# Altium schematic sheet SENSE.SchDoc: SENSE
size A4; DrawnBy: Lucas Church; DocumentNumber: N/A; Revision: A; SheetNumber: 5; SheetTotal: 6
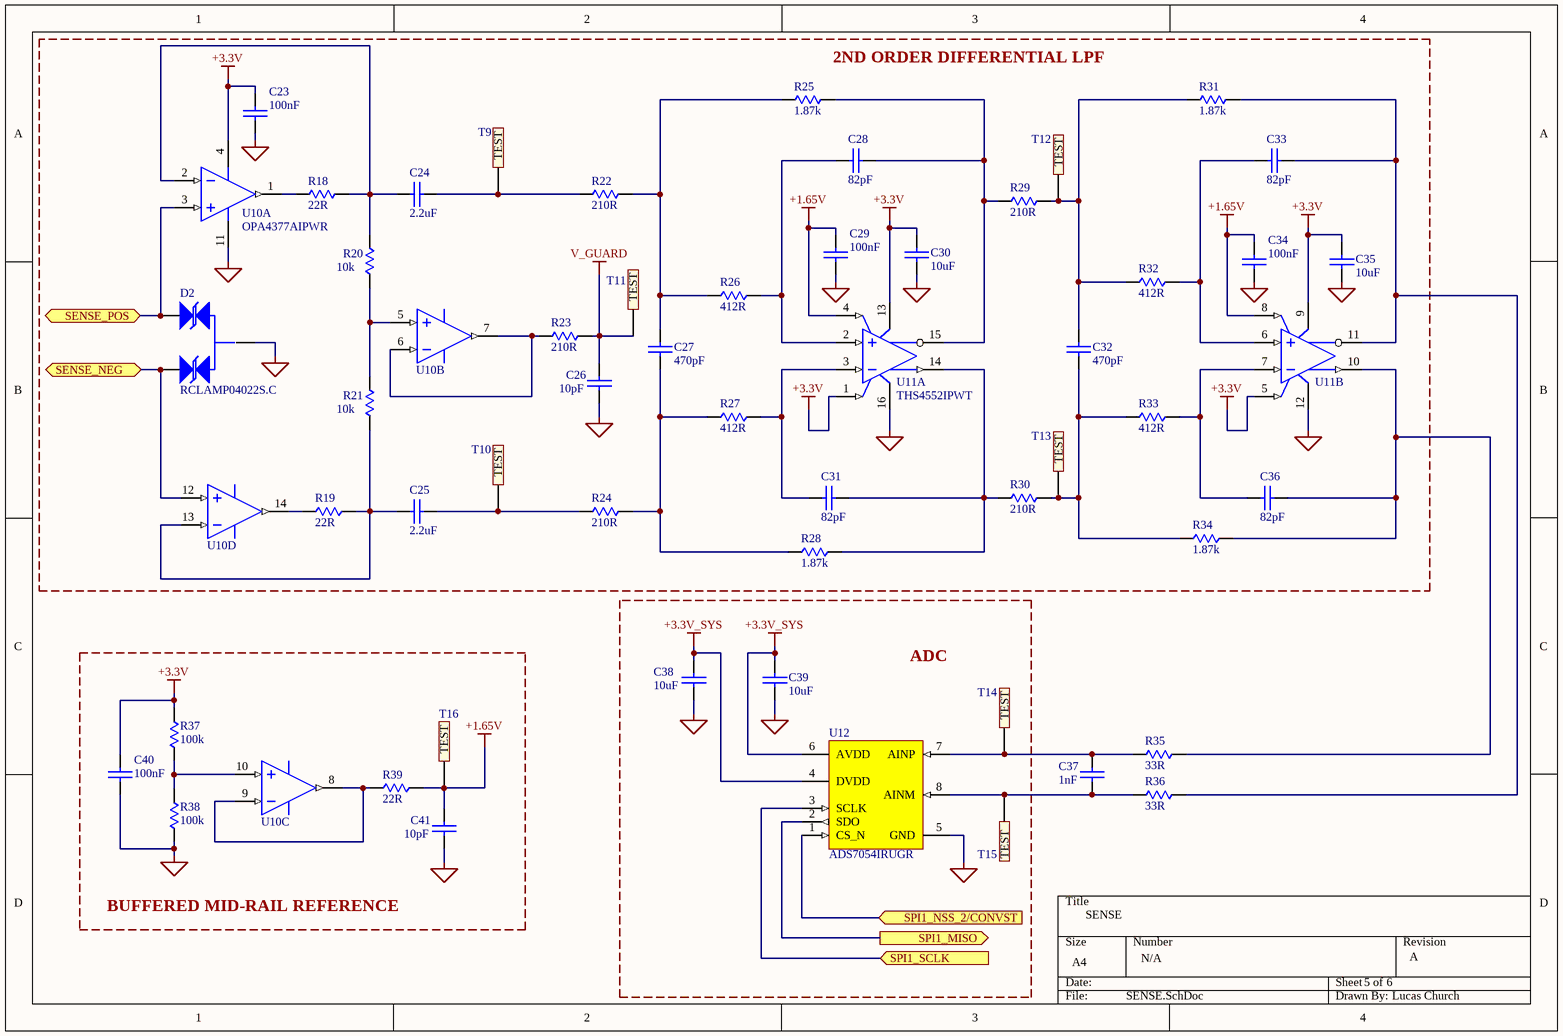
[diagram p0: SENSE.SchDoc]

## Parts
C23  100nF  [0603-CAP]
C24  2.2uF  [0603-CAP]
C25  2.2uF  [0603-CAP]
C26  10pF  [0603-CAP]
C27  470pF  [0603-CAP]
C28  82pF  [0603-CAP]
C29  100nF  [0603-CAP]
C30  10uF  [0603-CAP]
C31  82pF  [0603-CAP]
C32  470pF  [0603-CAP]
C33  82pF  [0603-CAP]
C34  100nF  [0603-CAP]
C35  10uF  [0603-CAP]
C36  82pF  [0603-CAP]
C37  1nF  [0603-CAP]
C38  10uF  [0603-CAP]
C39  10uF  [0603-CAP]
C40  100nF  [0603-CAP]
C41  10pF  [0603-CAP]
D2  RCLAMP04022S.C  [SOT-23 3L]
R18  22R  [0603-RES]
R19  22R  [0603-RES]
R20  10k  [0603-RES]
R21  10k  [0603-RES]
R22  210R  [0603-RES]
R23  210R  [0603-RES]
R24  210R  [0603-RES]
R25  1.87k  [0603-RES]
R26  412R  [0603-RES]
R27  412R  [0603-RES]
R28  1.87k  [0603-RES]
R29  210R  [0603-RES]
R30  210R  [0603-RES]
R31  1.87k  [0603-RES]
R32  412R  [0603-RES]
R33  412R  [0603-RES]
R34  1.87k  [0603-RES]
R35  33R  [0603-RES]
R36  33R  [0603-RES]
R37  100k  [0603-RES]
R38  100k  [0603-RES]
R39  22R  [0603-RES]
T9  5002K  [TESTPOINT White]  (value not drawn)
T10  5002K  [TESTPOINT White]  (value not drawn)
T11  5002K  [TESTPOINT White]  (value not drawn)
T12  5002K  [TESTPOINT White]  (value not drawn)
T13  5002K  [TESTPOINT White]  (value not drawn)
T14  5002K  [TESTPOINT White]  (value not drawn)
T15  5002K  [TESTPOINT White]  (value not drawn)
T16  5002K  [TESTPOINT White]  (value not drawn)
U10  OPA4377AIPWR  [PW0014A_N]  (parts A,B,C,D of 4)
U11  THS4552IPWT  [PW0016A_N]  (parts A,B of 2)
U12  ADS7054IRUGR  [8-X2QFN (1.5x1.5)]

## Blocks framed on the sheet
2ND ORDER DIFFERENTIAL LPF: C23-C36 D2 R18-R34 T9-T13 U10 U11
ADC: C38 C39 T14 T15 U12
BUFFERED MID-RAIL REFERENCE: C40 C41 R37-R39 T16 U10

## Ports
SENSE_NEG (bidir, see BLOCK DIAGRAM[3C], LOADS[4A]), SENSE_POS (bidir, see BLOCK DIAGRAM[3C], LOADS[4A]), SPI1_MISO (out, see BLOCK DIAGRAM[2C], MCU[1A]), SPI1_NSS_2/CONVST (in, see BLOCK DIAGRAM[2C], MCU[3A]), SPI1_SCLK (in, see BLOCK DIAGRAM[2C], MCU[1A])

## Nets
+1.65V: C29.1 C34.1 C41.1 R39.2 T16.1(TEST) U11.4(VOCM1) U11.8(VOCM2)
+3.3V: C23.1 C30.1 C35.1 C40.1 R37.2 U10.4(V+) U11.1(PD1_N) U11.5(PD2_N) U11.9(VS2+) U11.13(VS1+)
+3.3V_SYS: C38.1 C39.1 U12.4(DVDD) U12.6(AVDD)
GND: C23.2 C26.2 C29.2 C30.2 C34.2 C35.2 C38.2 C39.2 C40.2 C41.2 D2.3 R38.1 U10.11(V-) U11.12(VS-) U11.16(VS-) U12.5(GND)
V_GUARD: C26.1 R23.2 T11.1(TEST)
SENSE_NEG: D2.2 U10.12(IN_D+) ; port SENSE_NEG
SENSE_POS: D2.1 U10.3(IN_A+) ; port SENSE_POS
SPI1_MISO: U12.2(SDO) ; port SPI1_MISO
SPI1_NSS_2/CONVST: U12.1(CS_N) ; port SPI1_NSS_2/CONVST
SPI1_SCLK: U12.3(SCLK) ; port SPI1_SCLK
NetC24_1: C24.1 R22.1 T9.1(TEST)
NetC24_2: C24.2 R18.2 R20.1 U10.2(IN_A-)
NetC25_1: C25.1 R24.1 T10.1(TEST)
NetC25_2: C25.2 R19.2 R21.2 U10.13(IN_D-)
NetC27_1: C27.1 R24.2 R27.1 R28.1
NetC27_2: C27.2 R22.2 R25.1 R26.1
NetC28_1: C28.1 R26.2 U11.2(VIN1+)
NetC28_2: C28.2 R25.2 R29.1 U11.15(VOUT1-)
NetC31_1: C31.1 R27.2 U11.3(VIN1-)
NetC31_2: C31.2 R28.2 R30.1 U11.14(VOUT1+)
NetC32_1: C32.1 R30.2 R33.1 R34.1 T13.1(TEST)
NetC32_2: C32.2 R29.2 R31.1 R32.1 T12.1(TEST)
NetC33_1: C33.1 R32.2 U11.6(VIN2+)
NetC33_2: C33.2 R31.2 R36.2 U11.11(VOUT2-)
NetC36_1: C36.1 R33.2 U11.7(VIN2-)
NetC36_2: C36.2 R34.2 R35.2 U11.10(VOUT2+)
NetC37_1: C37.1 R35.1 T14.1(TEST) U12.7(AINP)
NetC37_2: C37.2 R36.1 T15.1(TEST) U12.8(AINM)
NetR18_1: R18.1 U10.1(OUT_A)
NetR19_1: R19.1 U10.14(OUT_D)
NetR20_2: R20.2 R21.1 U10.5(IN_B+)
NetR23_1: R23.1 U10.6(IN_B-) U10.7(OUT_B)
NetR37_1: R37.1 R38.2 U10.10(IN_C+)
NetR39_1: R39.1 U10.8(OUT_C) U10.9(IN_C-)

## Library data of the parts
C23 C29 C34 C40 = CGA3E2C0G1H472J080AA: CAP CER 100 NF 50V X7R 0603; Manufacturer Part Number 1: CC0603KRX7R9BB104; Manufacturer 1: YAGEO; Tech#: SMT; Detailed Description: CAP CER 100 NF 50V X7R 0603; Supplier 1: DigiKey; Supplier Part Number 1: 311-1344-1-ND; Supplier 2: Mouser; Supplier Part Number 2: 810-CGA3E2C0G1H472J; Price(100): 0.1434; Price(250): 0.10756
C24 C25 = CGA3E2C0G1H472J080AA: CAP CER 2.2UF 35V X5R 0603; Manufacturer Part Number 1: GRM188R6YA225MA12D; Manufacturer 1: Murata Electronics; Tech#: SMT; Detailed Description: CAP CER 2.2UF 35V X5R 0603; Supplier 1: DigiKey; Supplier Part Number 1: 490-10486-1-ND; Supplier 2: Mouser; Supplier Part Number 2: 810-CGA3E2C0G1H472J; Price(100): 0.1434; Price(250): 0.10756
C26 C41 = CGA3E2C0G1H472J080AA: CAP CER 10PF 50V C0G/NPO 0603; Manufacturer Part Number 1: CC0603JRNPO9BN100; Manufacturer 1: YAGEO; Tech#: SMT; Detailed Description: CAP CER 10PF 50V C0G/NPO 0603; Supplier 1: DigiKey; Supplier Part Number 1: 311-1058-1-ND; Supplier 2: Mouser; Supplier Part Number 2: 810-CGA3E2C0G1H472J; Price(100): 0.1434; Price(250): 0.10756
C27 C32 = CGA3E2C0G1H472J080AA: CAP CER 470PF 50V C0G 0603; Manufacturer Part Number 1: CL10C471JB8NNNC; Manufacturer 1: Samsung; Tech#: SMT; Detailed Description: CAP CER 470PF 50V C0G 0603; Supplier 1: DigiKey; Supplier Part Number 1: 1276-1168-1-ND; Supplier 2: Mouser; Supplier Part Number 2: 810-CGA3E2C0G1H472J; Price(100): 0.1434; Price(250): 0.10756
C28 C31 C33 C36 = CGA3E2C0G1H472J080AA: CAP CER 82PF 50V C0G 0603; Manufacturer Part Number 1: C0603C820J5GACTU; Manufacturer 1: KEMET; Tech#: SMT; Detailed Description: CAP CER 82PF 50V C0G 0603; Supplier 1: DigiKey; Supplier Part Number 1: 399-C0603C820J5GACTUCT-ND; Supplier 2: Mouser; Supplier Part Number 2: 810-CGA3E2C0G1H472J; Price(100): 0.1434; Price(250): 0.10756
C30 C35 C38 C39 = CGA3E2C0G1H472J080AA: CAP CER 10uF 6.3V X5R 0603; Manufacturer Part Number 1: GRM188Z71A106KA73D; Manufacturer 1: Murata Electronics; Detailed Description: CAP CER 100 NF 50V X7R 0603; Tech#: SMT; Supplier 1: DigiKey; Supplier Part Number 1: 490-GRM188Z71A106KA73DCT-ND; Supplier 2: Mouser; Supplier Part Number 2: 810-CGA3E2C0G1H472J; Price(100): 0.1434; Price(250): 0.10756
C37 = CGA3E2C0G1H472J080AA: CAP CER 1000 PF 50V C0G 0603; Manufacturer Part Number 1: GRM1885C1H102JA01D; Manufacturer 1: Murata; Detailed Description: CAP CER 100 NF 50V X7R 0603; Tech#: SMT; Supplier 1: DigiKey; Supplier Part Number 1: 490-1451-1-ND; Supplier 2: Mouser; Supplier Part Number 2: 810-CGA3E2C0G1H472J; Price(100): 0.1434; Price(250): 0.10756
R18 R19 R39 = 4.99K 0603: RES SMD 22OHM 0.1% 1/10W 0603; Manufacturer Part Number 1: RT0603BRD0722RL; Manufacturer 1: YAGEO; Tech#: SMT; Detailed Description: RES SMD 22OHM 0.1% 1/10W 0603; Supplier 1: DigiKey; Supplier Part Number 1: 13-RT0603BRD0722RLCT-ND; Supplier 2: Mouser; Supplier Part Number 2: 754-RR0816P-4991D68H; Price(100): 0.023
R20 R21 = 4.99K 0603: RES SMD 10K OHM 1% 1/10W 0603; Manufacturer Part Number 1: ERJ-3EKF1002V; Manufacturer 1: Panasonic Industry; Tech#: SMT; Detailed Description: RES SMD 10K OHM 1% 1/10W 0603; Supplier 1: DigiKey; Supplier Part Number 1: P10.0KHCT-ND; Supplier 2: Mouser; Supplier Part Number 2: 754-RR0816P-4991D68H; Price(100): 0.023
R22-R24 R29 R30 = 4.99K 0603: RES SMD 210OHM 0.1% 1/10W 0603; Manufacturer Part Number 1: RT0603BRD07210RL; Manufacturer 1: YAGEO; Tech#: SMT; Detailed Description: RES SMD 210OHM 0.1% 1/10W 0603; Supplier 1: DigiKey; Supplier Part Number 1: YAG4502CT-ND; Supplier 2: Mouser; Supplier Part Number 2: 754-RR0816P-4991D68H; Price(100): 0.023
R25 R28 R31 R34 = 4.99K 0603: RES SMD 1.87KOHM 0.1% 1/10W 0603; Manufacturer Part Number 1: RT0603BRD071K87L; Manufacturer 1: YAGEO; Tech#: SMT; Detailed Description: RES SMD 1.87KOHM 0.1% 1/10W 0603; Supplier 1: DigiKey; Supplier Part Number 1: YAG4497CT-ND; Supplier 2: Mouser; Supplier Part Number 2: 754-RR0816P-4991D68H; Price(100): 0.023
R26 R27 R32 R33 = 4.99K 0603: RES SMD 412OHM 0.1% 1/10W 0603; Manufacturer Part Number 1: RT0603BRD07412RL; Manufacturer 1: YAGEO; Tech#: SMT; Detailed Description: RES SMD 412OHM 0.1% 1/10W 0603; Supplier 1: DigiKey; Supplier Part Number 1: YAG1659CT-ND; Supplier 2: Mouser; Supplier Part Number 2: 754-RR0816P-4991D68H; Price(100): 0.023
R35 R36 = 4.99K 0603: RES SMD 33OHM 0.1% 1/10W 0603; Manufacturer Part Number 1: RT0603BRD0733RL; Manufacturer 1: YAGEO; Tech#: SMT; Detailed Description: RES SMD 33OHM 0.1% 1/10W 0603; Supplier 1: DigiKey; Supplier Part Number 1: 13-RT0603BRD0733RLCT-ND; Supplier 2: Mouser; Supplier Part Number 2: 754-RR0816P-4991D68H; Price(100): 0.023
R37 R38 = 4.99K 0603: RES SMD 100KOHM 0.1% 1/10W 0603; Manufacturer Part Number 1: RT0603BRD07100KL; Manufacturer 1: YAGEO; Detailed Description: RES SMD 4.99KOHM 0.5% 1/16W 0603; Tech#: SMT; Supplier 1: DigiKey; Supplier Part Number 1: YAG1235CT-ND; Supplier 2: Mouser; Supplier Part Number 2: 754-RR0816P-4991D68H; Price(100): 0.023
T9-T16 = 5002K: PC TEST POINT MINIATURE WHITE; Manufacturer 1: Keystone Electronics; Detailed Description: Connector, TestPoint White; Location: F1-33; Tech#: T/H; Manufacturer Part Number 1: 5002K; Supplier 1: DigiKey; Supplier Part Number 1: 36-5002-ND; Supplier 2: Mouser; Supplier Part Number 2: 534-5002; Price(1): 0.56; Price(10): 0.506; Price(100): 0.3541
U10 = CMP-0272-01748-3: Low-Cost, Low Noise, 5.5 MHz CMOS Operational Amplifier, 2.2 to 5.5 V, -40 to 125 degC, 14-pin SOP (PW14), Green (RoHS & no Sb/Br); Manufacturer: Texas Instruments; Number of Channels: 4; Iq per channel(Max)(mA): 1.05; Vn at 1kHz(Typ)(nV/rtHz): 7.5; Offset Drift(Typ)(uV/C): 0.32; Slew Rate(Typ)(V/us): 2; IIB(Max)(pA): 10; Sub Family: Low Input Bias Current Amp (<=10pA), Low Noise Amp (<=10nV/rtHz), Low Supply Voltage Amplifier (<=2.7V), Precision Amplifier; Total Supply Voltage(Max)(+5V is 5, +/-5V is 10): 5.5; Vio (25C)(Max)(mV): 1; CMRR(Min)(dB): 70; Total Supply Voltage(Min)(+5V is 5, +/-5V is 10): 2.2; Code_JEDEC: MO-153; ComponentLink3URL: http://www.ti.com/litv/pdf/mpds360; PackageReference: PW0014A; PackageDescription: 14-Pin Plastic Small Outline, Body 5 x 4.4 mm, Pitch 0.65 mm; ComponentLink1URL: http://www.ti.com/; Mounting Technology: Surface Mount; PartNumber: OPA4377AIPWR; Eco-Plan: Green (RoHS & no Sb/Br); ComponentLink3Description: Package Specification; ComponentLink2Description: Datasheet; DatasheetVersion: SBOS504B; ComponentLink1Description: Manufacturer URL; ComponentLink2URL: http://www.ti.com/general/docs/lit/getliterature.tsp?genericPartNumber=OPA4377&fileType=pdf; PackageVersion: 4040064-3/G, 02/2011
U11 = THS4552IPWT: Dual Channel, Low-Noise, Precision, 150-MHz, Fully Differential Amplifier 16-TSSOP -40 to 125; Manufacturer_Name: Texas Instruments; TYPE: TYPE; RefDes: RefDes; Copyright: Copyright (C) 2025 Ultra Librarian. All rights reserved.; Manufacturer_Part_Number: THS4552IPWT
U12 = ADS7054IRUGR: 14-Bit, 1MSPS, Differential Input, Small-Size Low-Power SAR ADC 8-X2QFN -40 to 125; Manufacturer_Name: Texas Instruments; TYPE: TYPE; RefDes: RefDes; Copyright: Copyright (C) 2026 Ultra Librarian. All rights reserved.; Manufacturer_Part_Number: ADS7054IRUGR